# Altium schematic sheet 小车主板原理图1.SchDoc
size A3
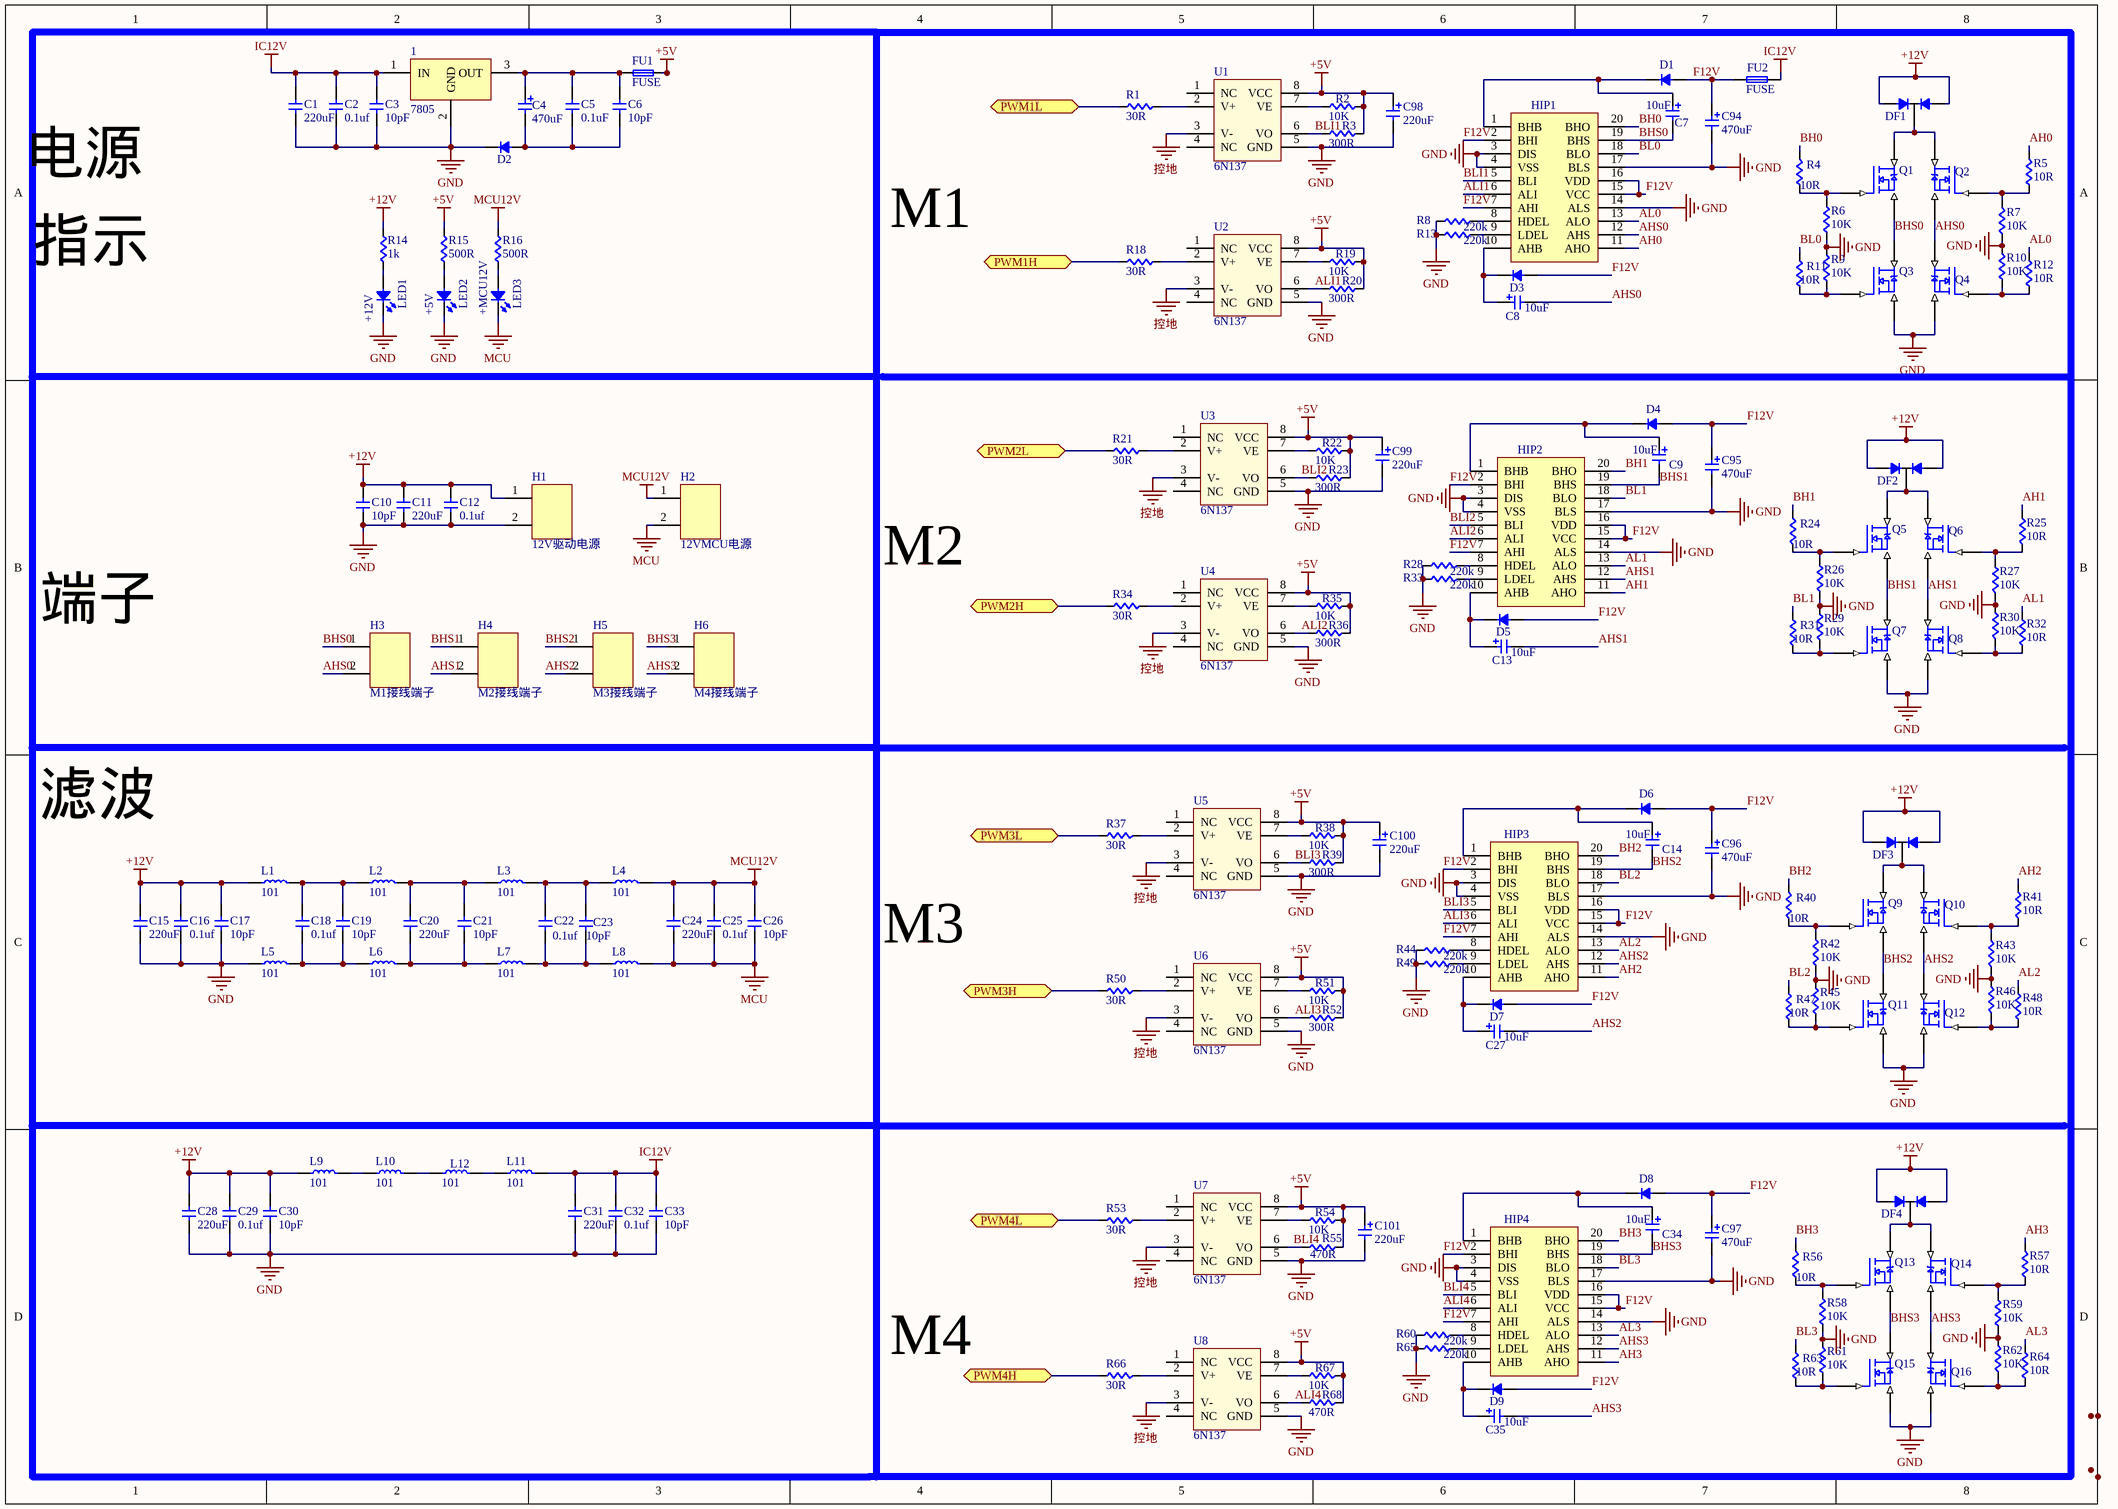
[diagram p0: 小车主板原理图1.SchDoc]

## Parts
1  7805  [TO-252-2]
C1  220uF  [CD-8*8-无极性]
C2  0.1uf  [0805C]
C3  10pF  [0805C]
C4  470uF  [CD-8*8-2]
C5  0.1uF  [0805C]
C6  10pF  [0805C]
C7  10uF  [CD-8*8-2]
C8  10uF  [CD-8*8-2]
C9  10uF  [CD-8*8-2]
C10  10pF  [0805C]
C11  220uF  [CD-8*8-无极性]
C12  0.1uf  [0805C]
C13  10uF  [CD-8*8-2]
C14  10uF  [CD-8*8-2]
C15  220uF  [CD-8*8-无极性]
C16  0.1uf  [0805C]
C17  10pF  [0805C]
C18  0.1uf  [0805C]
C19  10pF  [0805C]
C20  220uF  [CD-8*8-无极性]
C21  10pF  [0805C]
C22  0.1uf  [0805C]
C23  10pF  [0805C]
C24  220uF  [CD-8*8-无极性]
C25  0.1uf  [0805C]
C26  10pF  [0805C]
C27  10uF  [CD-8*8-2]
C28  220uF  [CD-8*8-无极性]
C29  0.1uf  [0805C]
C30  10pF  [0805C]
C31  220uF  [CD-8*8-无极性]
C32  0.1uf  [0805C]
C33  10pF  [0805C]
C34  10uF  [CD-8*8-2]
C35  10uF  [CD-8*8-2]
C94  470uF  [CD-8*8-2]
C95  470uF  [CD-8*8-2]
C96  470uF  [CD-8*8-2]
C97  470uF  [CD-8*8-2]
C98  220uF  [CD-8*8-2]
C99  220uF  [CD-8*8-2]
C100  220uF  [CD-8*8-2]
C101  220uF  [CD-8*8-2]
D1  D  [DO-214-M7-  4007贴片]  (value not drawn)
D2  D  [DO-214-M7-  4007贴片]  (value not drawn)
D3  D  [DO-214-M7-  4007贴片]  (value not drawn)
D4  D  [DO-214-M7-  4007贴片]  (value not drawn)
D5  D  [DO-214-M7-  4007贴片]  (value not drawn)
D6  D  [DO-214-M7-  4007贴片]  (value not drawn)
D7  D  [DO-214-M7-  4007贴片]  (value not drawn)
D8  D  [DO-214-M7-  4007贴片]  (value not drawn)
D9  D  [DO-214-M7-  4007贴片]  (value not drawn)
DF1  DF?  [TO263]  (value not drawn)
DF2  DF?  [TO263]  (value not drawn)
DF3  DF?  [TO263]  (value not drawn)
DF4  DF?  [TO263]  (value not drawn)
FU1  FUSE  [1206]
FU2  FUSE  [1206]
H1  12V驱动电源  [KF301接线端子]
H2  12VMCU电源  [KF301接线端子]
H3  M1接线端子  [KF301接线端子]
H4  M2接线端子  [KF301接线端子]
H5  M3接线端子  [KF301接线端子]
H6  M4接线端子  [KF301接线端子]
HIP1  HIP4081  [SOP-20..]  (value not drawn)
HIP2  HIP4081  [SOP-20..]  (value not drawn)
HIP3  HIP4081  [SOP-20..]  (value not drawn)
HIP4  HIP4081  [SOP-20..]  (value not drawn)
L1  value 101  [12*12电感]  (hidden comment: L)
L2  value 101  [12*12电感]  (hidden comment: L)
L3  value 101  [12*12电感]  (hidden comment: L)
L4  value 101  [12*12电感]  (hidden comment: L)
L5  value 101  [12*12电感]  (hidden comment: L)
L6  value 101  [12*12电感]  (hidden comment: L)
L7  value 101  [12*12电感]  (hidden comment: L)
L8  value 101  [12*12电感]  (hidden comment: L)
L9  value 101  [12*12电感]  (hidden comment: L)
L10  value 101  [12*12电感]  (hidden comment: L)
L11  value 101  [12*12电感]  (hidden comment: L)
L12  value 101  [12*12电感]  (hidden comment: L)
LED1  +12V  [0805D]
LED2  +5V  [0805D]
LED3  +MCU12V  [0805D]
Q1  IRFP260N  [TO-247 - 贴]  (value not drawn)
Q2  IRFP260N  [TO-247 - 贴]  (value not drawn)
Q3  IRFP260N  [TO-247 - 贴]  (value not drawn)
Q4  IRFP260N  [TO-247 - 贴]  (value not drawn)
Q5  IRFP260N  [TO-247 - 贴]  (value not drawn)
Q6  IRFP260N  [TO-247 - 贴]  (value not drawn)
Q7  IRFP260N  [TO-247 - 贴]  (value not drawn)
Q8  IRFP260N  [TO-247 - 贴]  (value not drawn)
Q9  IRFP260N  [TO-247 - 贴]  (value not drawn)
Q10  IRFP260N  [TO-247 - 贴]  (value not drawn)
Q11  IRFP260N  [TO-247 - 贴]  (value not drawn)
Q12  IRFP260N  [TO-247 - 贴]  (value not drawn)
Q13  IRFP260N  [TO-247 - 贴]  (value not drawn)
Q14  IRFP260N  [TO-247 - 贴]  (value not drawn)
Q15  IRFP260N  [TO-247 - 贴]  (value not drawn)
Q16  IRFP260N  [TO-247 - 贴]  (value not drawn)
R1  30R  [0805]
R2  10K  [0805]
R3  300R  [0805]
R4  10R  [0805]
R5  10R  [0805]
R6  10K  [0805]
R7  10K  [0805]
R8  220k  [0805]
R9  10K  [0805]
R10  10K  [0805]
R11  10R  [0805]
R12  10R  [0805]
R13  220k  [0805]
R14  1k  [0805]
R15  500R  [0805]
R16  500R  [0805]
R18  30R  [0805]
R19  10K  [0805]
R20  300R  [0805]
R21  30R  [0805]
R22  10K  [0805]
R23  300R  [0805]
R24  10R  [0805]
R25  10R  [0805]
R26  10K  [0805]
R27  10K  [0805]
R28  220k  [0805]
R29  10K  [0805]
R30  10K  [0805]
R31  10R  [0805]
R32  10R  [0805]
R33  220k  [0805]
R34  30R  [0805]
R35  10K  [0805]
R36  300R  [0805]
R37  30R  [0805]
R38  10K  [0805]
R39  300R  [0805]
R40  10R  [0805]
R41  10R  [0805]
R42  10K  [0805]
R43  10K  [0805]
R44  220k  [0805]
R45  10K  [0805]
R46  10K  [0805]
R47  10R  [0805]
R48  10R  [0805]
R49  220k  [0805]
R50  30R  [0805]
R51  10K  [0805]
R52  300R  [0805]
R53  30R  [0805]
R54  10K  [0805]
R55  470R  [0805]
R56  10R  [0805]
R57  10R  [0805]
R58  10K  [0805]
R59  10K  [0805]
R60  220k  [0805]
R61  10K  [0805]
R62  10K  [0805]
R63  10R  [0805]
R64  10R  [0805]
R65  220k  [0805]
R66  30R  [0805]
R67  10K  [0805]
R68  470R  [0805]
U1  6N137  [SOP-8]
U2  6N137  [SOP-8]
U3  6N137  [SOP-8]
U4  6N137  [SOP-8]
U5  6N137  [SOP-8]
U6  6N137  [SOP-8]
U7  6N137  [SOP-8]
U8  6N137  [SOP-8]

## Ports
PWM1H, PWM1L, PWM2H, PWM2L, PWM3H, PWM3L, PWM4H, PWM4L

## Nets
+5V: C98.1 C99.1 C100.1 C101.1 FU1.2 R2.1 R3.1 R15.2 R19.1 R20.1 R22.1 R23.1 R35.1 R36.1 R38.1 R39.1 R51.1 R52.1 R54.1 R55.1 R67.1 R68.1 U1.8(VCC) U2.8(VCC) U3.8(VCC) U4.8(VCC) U5.8(VCC) U6.8(VCC) U7.8(VCC) U8.8(VCC)
+12V: C10.2 C11.2 C12.2 C15.2 C16.2 C17.2 C28.2 C29.2 C30.2 DF1.1(A) DF1.3(C) DF2.1(A) DF2.3(C) DF3.1(A) DF3.3(C) DF4.1(A) DF4.3(C) H1.1 L1.1 L9.1 R14.2
GND: 1.2(GND) C1.1 C2.1 C3.1 C10.1 C11.1 C12.1 C15.1 C16.1 C17.1 C28.1 C29.1 C30.1 C31.1 C32.1 C33.1 C94.2 C95.2 C96.2 C97.2 C98.2 C99.2 C100.2 C101.2 D2.2(K) H1.2 HIP1.3(DIS) HIP1.4(VSS) HIP1.14(ALS) HIP1.17(BLS) HIP2.3(DIS) HIP2.4(VSS) HIP2.14(ALS) HIP2.17(BLS) HIP3.3(DIS) HIP3.4(VSS) HIP3.14(ALS) HIP3.17(BLS) HIP4.3(DIS) HIP4.4(VSS) HIP4.14(ALS) HIP4.17(BLS) L5.1 LED1.2(K) LED2.2(K) Q3.3(S) Q4.3(S) Q7.3(S) Q8.3(S) Q11.3(S) Q12.3(S) Q15.3(S) Q16.3(S) R6.1 R7.1 R8.2 R9.2 R10.2 R13.2 R26.1 R27.1 R28.2 R29.2 R30.2 R33.2 R42.1 R43.1 R44.2 R45.2 R46.2 R49.2 R58.1 R59.1 R60.2 R61.2 R62.2 R65.2 U1.5(GND) U2.5(GND) U3.5(GND) U4.5(GND) U5.5(GND) U6.5(GND) U7.5(GND) U8.5(GND)
IC12V: 1.1(IN) C1.2 C2.2 C3.2 C31.2 C32.2 C33.2 FU2.2 L11.2
MCU: C24.1 C25.1 C26.1 H2.2 L8.2 LED3.2(K)
MCU12V: C24.2 C25.2 C26.2 H2.1 L4.2 R16.2
控地: U1.3(V-) U2.3(V-) U3.3(V-) U4.3(V-) U5.3(V-) U6.3(V-) U7.3(V-) U8.3(V-)
AH0: HIP1.11(AHO) R5.2
AH1: HIP2.11(AHO) R25.2
AH2: HIP3.11(AHO) R41.2
AH3: HIP4.11(AHO) R57.2
AHS0: C8.2 H3.2 HIP1.12(AHS) Q2.3(S) Q4.2(D)
AHS1: C13.2 H4.2 HIP2.12(AHS) Q6.3(S) Q8.2(D)
AHS2: C27.2 H5.2 HIP3.12(AHS) Q10.3(S) Q12.2(D)
AHS3: C35.2 H6.2 HIP4.12(AHS) Q14.3(S) Q16.2(D)
AL0: HIP1.13(ALO) R12.2
AL1: HIP2.13(ALO) R32.2
AL2: HIP3.13(ALO) R48.2
AL3: HIP4.13(ALO) R64.2
ALI1: HIP1.6(ALI) R20.2 U2.6(VO)
ALI2: HIP2.6(ALI) R36.2 U4.6(VO)
ALI3: HIP3.6(ALI) R52.2 U6.6(VO)
ALI4: HIP4.6(ALI) R68.2 U8.6(VO)
BH0: HIP1.20(BHO) R4.1
BH1: HIP2.20(BHO) R24.1
BH2: HIP3.20(BHO) R40.1
BH3: HIP4.20(BHO) R56.1
BHS0: C7.2 H3.1 HIP1.19(BHS) Q1.3(S) Q3.2(D)
BHS1: C9.2 H4.1 HIP2.19(BHS) Q5.3(S) Q7.2(D)
BHS2: C14.2 H5.1 HIP3.19(BHS) Q9.3(S) Q11.2(D)
BHS3: C34.2 H6.1 HIP4.19(BHS) Q13.3(S) Q15.2(D)
BL0: HIP1.18(BLO) R11.2
BL1: HIP2.18(BLO) R31.2
BL2: HIP3.18(BLO) R47.2
BL3: HIP4.18(BLO) R63.2
BLI1: HIP1.5(BLI) R3.2 U1.6(VO)
BLI2: HIP2.5(BLI) R23.2 U3.6(VO)
BLI3: HIP3.5(BLI) R39.2 U5.6(VO)
BLI4: HIP4.5(BLI) R55.2 U7.6(VO)
F12V: C94.1 C95.1 C96.1 C97.1 D1.1(A) D3.1(A) D4.1(A) D5.1(A) D6.1(A) D7.1(A) D8.1(A) D9.1(A) FU2.1 HIP1.2(BHI) HIP1.7(AHI) HIP1.15(VCC) HIP1.16(VDD) HIP2.2(BHI) HIP2.7(AHI) HIP2.15(VCC) HIP2.16(VDD) HIP3.2(BHI) HIP3.7(AHI) HIP3.15(VCC) HIP3.16(VDD) HIP4.2(BHI) HIP4.7(AHI) HIP4.15(VCC) HIP4.16(VDD)
PWM1H: R18.1 ; port PWM1H
PWM1L: R1.1 ; port PWM1L
PWM2H: R34.1 ; port PWM2H
PWM2L: R21.1 ; port PWM2L
PWM3H: R50.1 ; port PWM3H
PWM3L: R37.1 ; port PWM3L
PWM4H: R66.1 ; port PWM4H
PWM4L: R53.1 ; port PWM4L
Net1_3: 1.3(OUT) C4.1 C5.2 C6.2 FU1.1
NetC4_2: C4.2 C5.1 C6.1 D2.1(A)
NetC7_1: C7.1 D1.2(K) HIP1.1(BHB)
NetC8_1: C8.1 D3.2(K) HIP1.10(AHB)
NetC9_1: C9.1 D4.2(K) HIP2.1(BHB)
NetC13_1: C13.1 D5.2(K) HIP2.10(AHB)
NetC14_1: C14.1 D6.2(K) HIP3.1(BHB)
NetC18_1: C18.1 C19.1 L5.2 L6.1
NetC18_2: C18.2 C19.2 L1.2 L2.1
NetC20_1: C20.1 C21.1 L6.2 L7.1
NetC20_2: C20.2 C21.2 L2.2 L3.1
NetC22_1: C22.1 C23.1 L7.2 L8.1
NetC22_2: C22.2 C23.2 L3.2 L4.1
NetC27_1: C27.1 D7.2(K) HIP3.10(AHB)
NetC34_1: C34.1 D8.2(K) HIP4.1(BHB)
NetC35_1: C35.1 D9.2(K) HIP4.10(AHB)
NetDF1_2: DF1.2(B) Q1.2(D) Q2.2(D)
NetDF2_2: DF2.2(B) Q5.2(D) Q6.2(D)
NetDF3_2: DF3.2(B) Q9.2(D) Q10.2(D)
NetDF4_2: DF4.2(B) Q13.2(D) Q14.2(D)
NetHIP1_8: HIP1.8(HDEL) R8.1
NetHIP1_9: HIP1.9(LDEL) R13.1
NetHIP2_8: HIP2.8(HDEL) R28.1
NetHIP2_9: HIP2.9(LDEL) R33.1
NetHIP3_8: HIP3.8(HDEL) R44.1
NetHIP3_9: HIP3.9(LDEL) R49.1
NetHIP4_8: HIP4.8(HDEL) R60.1
NetHIP4_9: HIP4.9(LDEL) R65.1
NetL9_2: L9.2 L10.1
NetL10_2: L10.2 L12.1
NetL11_1: L11.1 L12.2
NetLED1_1: LED1.1(A) R14.1
NetLED2_1: LED2.1(A) R15.1
NetLED3_1: LED3.1(A) R16.1
NetQ1_1: Q1.1(G) R4.2 R6.2
NetQ2_1: Q2.1(G) R5.1 R7.2
NetQ3_1: Q3.1(G) R9.1 R11.1
NetQ4_1: Q4.1(G) R10.1 R12.1
NetQ5_1: Q5.1(G) R24.2 R26.2
NetQ6_1: Q6.1(G) R25.1 R27.2
NetQ7_1: Q7.1(G) R29.1 R31.1
NetQ8_1: Q8.1(G) R30.1 R32.1
NetQ9_1: Q9.1(G) R40.2 R42.2
NetQ10_1: Q10.1(G) R41.1 R43.2
NetQ11_1: Q11.1(G) R45.1 R47.1
NetQ12_1: Q12.1(G) R46.1 R48.1
NetQ13_1: Q13.1(G) R56.2 R58.2
NetQ14_1: Q14.1(G) R57.1 R59.2
NetQ15_1: Q15.1(G) R61.1 R63.1
NetQ16_1: Q16.1(G) R62.1 R64.1
NetR1_2: R1.2 U1.2(V+)
NetR2_2: R2.2 U1.7(VE)
NetR18_2: R18.2 U2.2(V+)
NetR19_2: R19.2 U2.7(VE)
NetR21_2: R21.2 U3.2(V+)
NetR22_2: R22.2 U3.7(VE)
NetR34_2: R34.2 U4.2(V+)
NetR35_2: R35.2 U4.7(VE)
NetR37_2: R37.2 U5.2(V+)
NetR38_2: R38.2 U5.7(VE)
NetR50_2: R50.2 U6.2(V+)
NetR51_2: R51.2 U6.7(VE)
NetR53_2: R53.2 U7.2(V+)
NetR54_2: R54.2 U7.7(VE)
NetR66_2: R66.2 U8.2(V+)
NetR67_2: R67.2 U8.7(VE)

Not connected (* = marked no-connect by the designer): U1 1(NC) 4(NC); U2 1(NC) 4(NC); U3 1(NC) 4(NC); U4 1(NC) 4(NC); U5 1(NC) 4(NC); U6 1(NC) 4(NC); U7 1(NC) 4(NC); U8 1(NC) 4(NC)

## Notes on the sheet
- 电源
- M1
- 指示
- M2
- 端子
- 滤波
- M3
- M4

## Library data of the parts
1 = 78XX
C1-C3 C5 C6 C10-C12 C15-C26 C28-C33 = C
C4 C7-C9 C13 C14 C27 C34 C35 C94-C101 = C+: Published: 8-Jun-2000; LatestRevisionDate: 17-Jul-2002; LatestRevisionNote: Re-released for DXP Platform.; PackageReference: RB7.6-15; Publisher: Altium Limited; PackageDescription: Polarized Capacitor (Radial); 2 Leads
D1-D9 = D: Value: 4007; Published: 8-Jun-2000; LatestRevisionDate: 17-Jul-2002; LatestRevisionNote: Re-released for DXP Platform.; PackageVersion: Sep-1996; PackageReference: SMC; Publisher: Altium Limited; PackageDescription: DO-214-AB/SMC; 2 C-Bend Leads; Body 7.9 x 5.9 mm, inc. leads (LxW); Code_JEDEC: DO-214-AB
DF1-DF4 = D复合二极管
H1-H6 = KF301 接线端子
L1-L12 = L: Code_IEC: 1005; Published: 8-Jun-2000; LatestRevisionDate: 29-May-2009; LatestRevisionNote: IPC-7351 Footprint Added.; PackageReference: 0402-A; Publisher: Altium Limited; PackageDescription: Chip Inductor; Code_JEITA: 0402
LED1-LED3 = LED: Published: 8-Jun-2000; LatestRevisionDate: 08-Jul-2005; LatestRevisionNote: Mech Layer 1 removed.; PackageReference: LED-0; Publisher: Altium Limited; PackageDescription: LED; 2 Leads
R1-R16 R18-R68 = Res